# EAGLE design RFM69Pi_V3.1 (EAGLE 7.2.0)
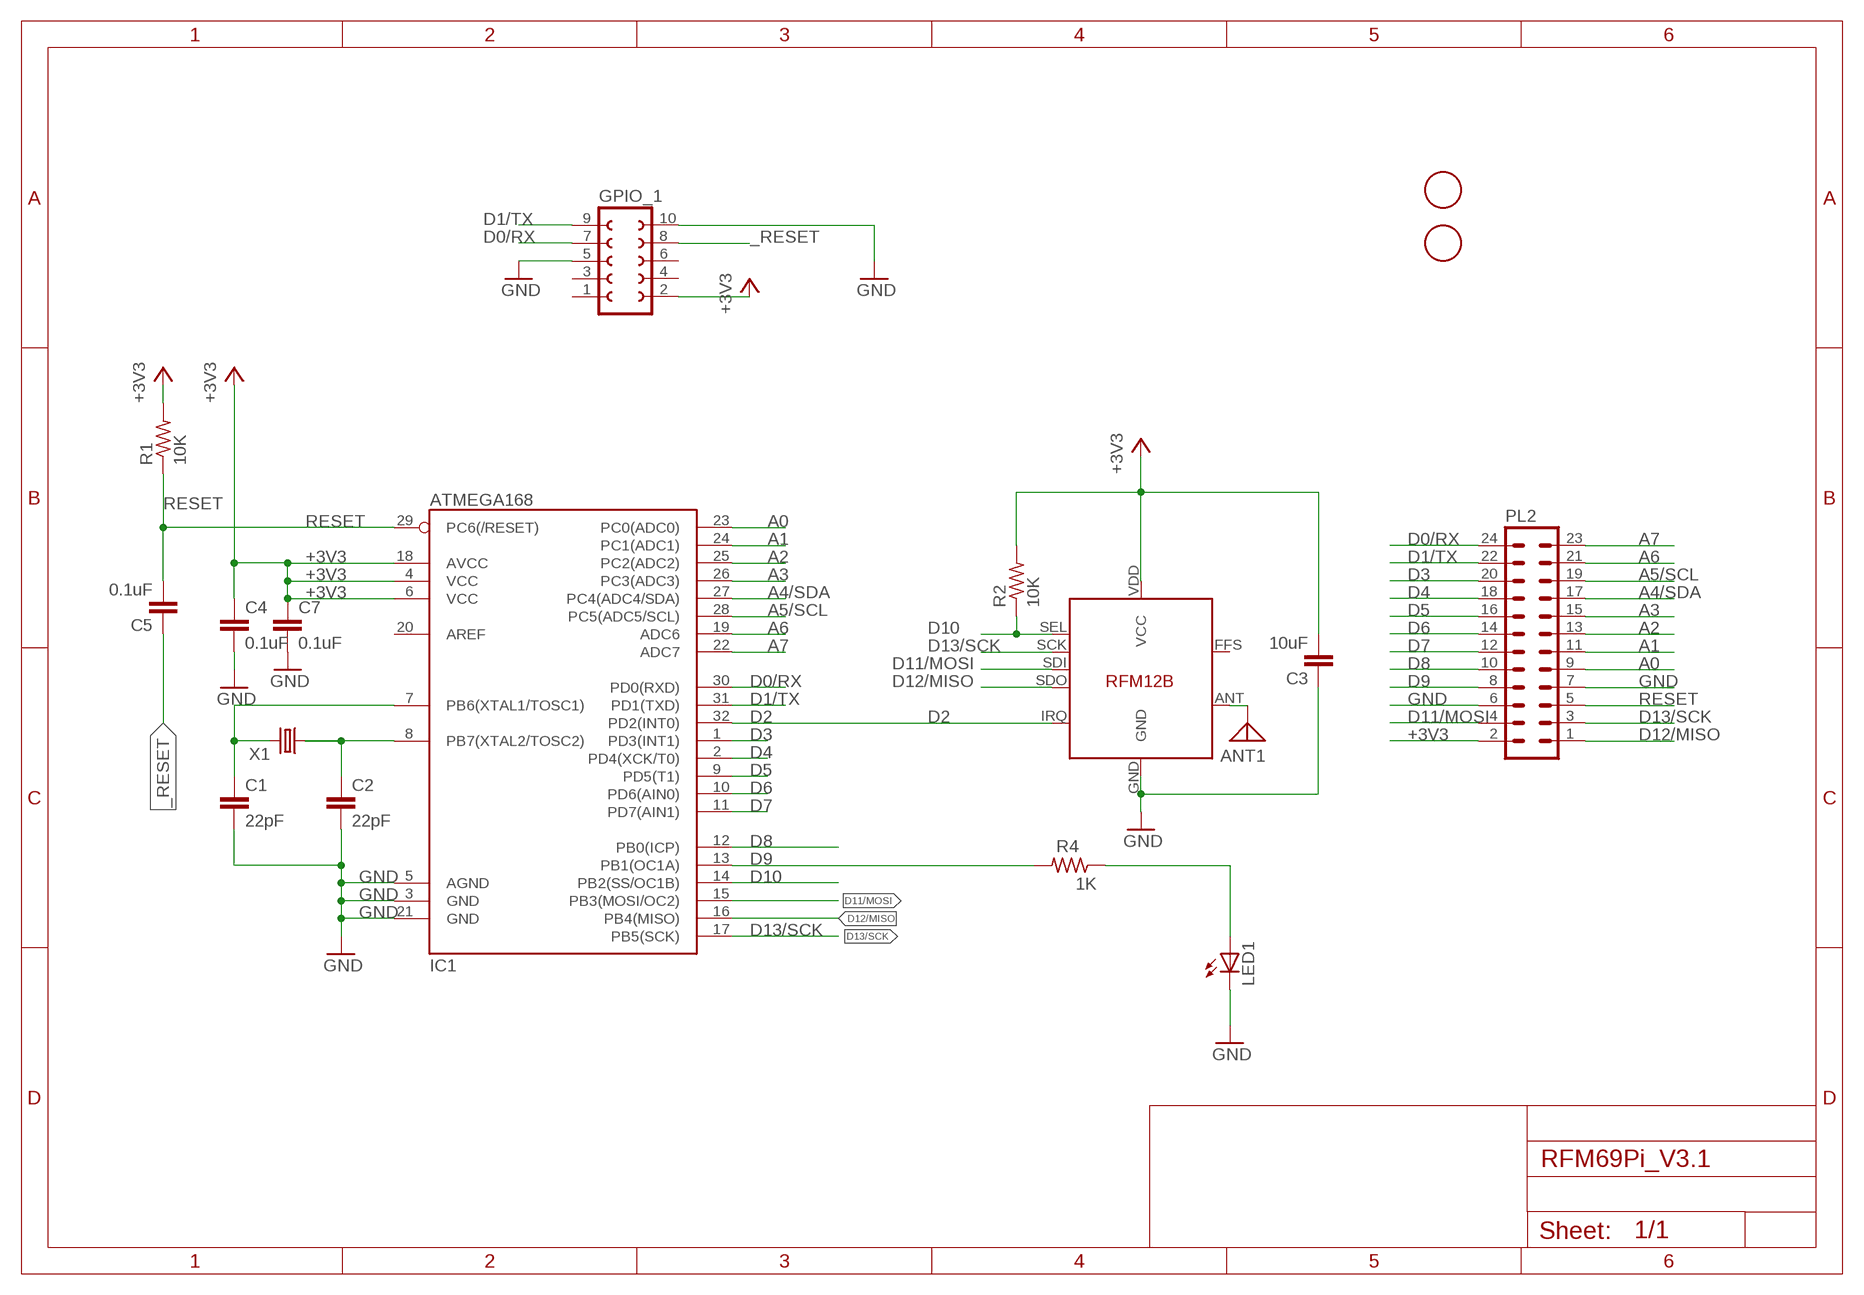
[diagram p0: schematic, sheet 1]

## Parts
ANT1  ANTENNA  [PAD-01]
C1  22pF  C-EUC0603  [C0603]
C2  22pF  C-EUC0603  [C0603]
C3  10uF  C-EUC0603  [C0603]
C4  0.1uF  C-EUC0603  [C0603]
C5  0.1uF  C-EUC0603  [C0603]
C7  0.1uF  C-EUC0603  [C0603]
GPIO_1  FE05-2  [FE05-2]
IC1  ATMEGA168  [TQFP32-08]
LED1  LEDSML0603  [SML0603]
PL2  MA12-2  [MA12-2]
R1  10K  R-US_R0603  [R0603]
R2  10K  R-US_R0603  [R0603]
R4  1K  R-US_R0603  [R0603]
RFM12B-RFM69CW  RFM12B  [RFM12B]
U$1  FIDUCIAL  [FIDUCIAL_1MM]
U$2  FIDUCIAL  [FIDUCIAL_1MM]
X1  CRYSTALHC49US  [HC49US]

## Nets
+3V3 [power]: C3.2 C4.1 C7.1 GPIO_1.2 IC1.4(VCC) IC1.6(VCC) IC1.18(AVCC) PL2.2 R1.2 R2.2 RFM12B-RFM69CW.VDD(VCC)
_RESET: C5.1 GPIO_1.8
A0: IC1.23(PC0(ADC0)) PL2.9
A1: IC1.24(PC1(ADC1)) PL2.11
A2: IC1.25(PC2(ADC2)) PL2.13
A3: IC1.26(PC3(ADC3)) PL2.15
A4/SDA: IC1.27(PC4(ADC4/SDA)) PL2.17
A5/SCL: IC1.28(PC5(ADC5/SCL)) PL2.19
A6: IC1.19(ADC6) PL2.21
A7: IC1.22(ADC7) PL2.23
D0/RX: GPIO_1.7 IC1.30(PD0(RXD)) PL2.24
D1/TX: GPIO_1.9 IC1.31(PD1(TXD)) PL2.22
D2: IC1.32(PD2(INT0)) RFM12B-RFM69CW.IRQ
D3: IC1.1(PD3(INT1)) PL2.20
D4: IC1.2(PD4(XCK/T0)) PL2.18
D5: IC1.9(PD5(T1)) PL2.16
D6: IC1.10(PD6(AIN0)) PL2.14
D7: IC1.11(PD7(AIN1)) PL2.12
D8: IC1.12(PB0(ICP)) PL2.10
D9: IC1.13(PB1(OC1A)) PL2.8 R4.2
D10: IC1.14(PB2(SS/OC1B)) R2.1 RFM12B-RFM69CW.SEL
D11/MOSI: IC1.15(PB3(MOSI/OC2)) PL2.4 RFM12B-RFM69CW.SDI
D12/MISO: IC1.16(PB4(MISO)) PL2.1 RFM12B-RFM69CW.SDO
D13/SCK: IC1.17(PB5(SCK)) PL2.3 RFM12B-RFM69CW.SCK
GND [power]: C1.2 C2.2 C3.1 C4.2 C7.2 GPIO_1.5 GPIO_1.10 IC1.3(GND) IC1.5(AGND) IC1.21(GND) LED1.C PL2.6 PL2.7 RFM12B-RFM69CW.GND
N$1: C1.1 IC1.7(PB6(XTAL1/TOSC1)) X1.2
N$2: C2.1 IC1.8(PB7(XTAL2/TOSC2)) X1.1
N$3: LED1.A R4.1
N$6 [power]: ANT1.1 RFM12B-RFM69CW.ANT
RESET: C5.2 IC1.29(PC6(/RESET)) PL2.5 R1.1
Unconnected: GPIO_1.1 GPIO_1.3 GPIO_1.4 GPIO_1.6 IC1.20(AREF) RFM12B-RFM69CW.FFS

## Library data of the parts
ANT1 = discrete:ANTENNA: Antenna
C1-C5 = rcl:C-EU: CAPACITOR, European symbol
C7 = resistor:C-EU: CAPACITOR, European symbol
GPIO_1 = con-lsta:FE05-2: FEMALE HEADER; OC_FARNELL: unknown; OC_NEWARK: unknown
IC1 = SparkFun:ATMEGA168
LED1 = led:LED: LED OSRAM: - CHIPLED LG R971, LG N971, LY N971, LG Q971, LY Q971, LO R971, LY R971 LH N974, LH R974 LS Q976, LO Q976, LY Q976 LO Q996 - Hyper CHIPLED LW Q18S LB Q993, LB Q99A, LB R99A - SideLED LS A670, LO A670, LY A670, LG A670, LP A670 LB A673, LV A673, LT A673, LW A673 LH A674 LY A675 LS A676, LA A676, LO A676, LY A676, LW A676 LS A679, LY A679, LG A679 - Hyper Micro SIDELED® LS Y876, LA Y876, LO Y876, LY Y876 LT Y87S - SmartLED LW L88C, LW L88S LB L89C, LB L89S, LG L890 LS L89K, LO L89K, LY L89K LS L896, LA L896, LO L896, LY L896 - TOPLED LS T670, LO T670, LY T670, LG T670, LP T670 LSG T670, LSP T670, LSY T670, LOP T670, LYG T670 LG T671, LOG T671, LSG T671 LB T673, LV T673, LT T673, LW T673 LH T674 LS T676, LA T676, LO T676, LY T676, LB T676, LH T676, LSB T676, LW T676 LB T67C, LV T67C, LT T67C, LS T67K, LO T67K, LY T67K, LW E67C LS E67B, LA E67B, LO E67B, LY E67B, LB E67C, LV E67C, LT E67C LW T67C LS T679, LY T679, LG T679 LS T770, LO T770, LY T770, LG T770, LP T770 LB T773, LV T773, LT T773, LW T773 LH T774 LS E675, LA E675, LY E675, LS T675 LS T776, LA T776, LO T776, LY T776, LB T776 LHGB T686 LT T68C, LB T68C - Hyper Mini TOPLED® LB M676 - Mini TOPLED Santana® LG M470 LS M47K, LO M47K, LY M47K Source: http://www.osram.convergy.de LUXEON: - LUMILED® LXK2-PW12-R00, LXK2-PW12-S00, LXK2-PW14-U00, LXK2-PW14-V00 LXK2-PM12-R00, LXK2-PM12-S00, LXK2-PM14-U00 LXK2-PE12-Q00, LXK2-PE12-R00, LXK2-PE12-S00, LXK2-PE14-T00, LXK2-PE14-U00 LXK2-PB12-K00, LXK2-PB12-L00, LXK2-PB12-M00, LXK2-PB14-N00, LXK2-PB14-P00, LXK2-PB14-Q00 LXK2-PR12-L00, LXK2-PR12-M00, LXK2-PR14-Q00, LXK2-PR14-R00 LXK2-PD12-Q00, LXK2-PD12-R00, LXK2-PD12-S00 LXK2-PH12-R00, LXK2-PH12-S00 LXK2-PL12-P00, LXK2-PL12-Q00, LXK2-PL12-R00 Source: www.luxeon.com KINGBRIGHT: KA-3528ASYC Source: www.kingbright.com
PL2 = con-lstb:MA12-2: PIN HEADER; OC_FARNELL: unknown; OC_NEWARK: unknown
R1 R2 R4 = adafruit:R-US_: RESISTOR, American symbol
RFM12B-RFM69CW = JeeLabs:RFM12B
U$1 U$2 = adafruit:FIDUCIAL: For use by pick and place machines to calibrate the vision/machine, 1mm By microbuilder.eu
X1 = SparkFun:CRYSTAL: Crystals Various standard crystals. Proven footprints. Spark Fun Electronics SKU : COM-00534

## Net classes
0 default: width 0.203 mm, drill 0.203 mm, clearance 0.205 mm
1 power: width 0.254 mm, drill 0.254 mm, clearance 0.205 mm to class 0, clearance 0.254 mm

## Board
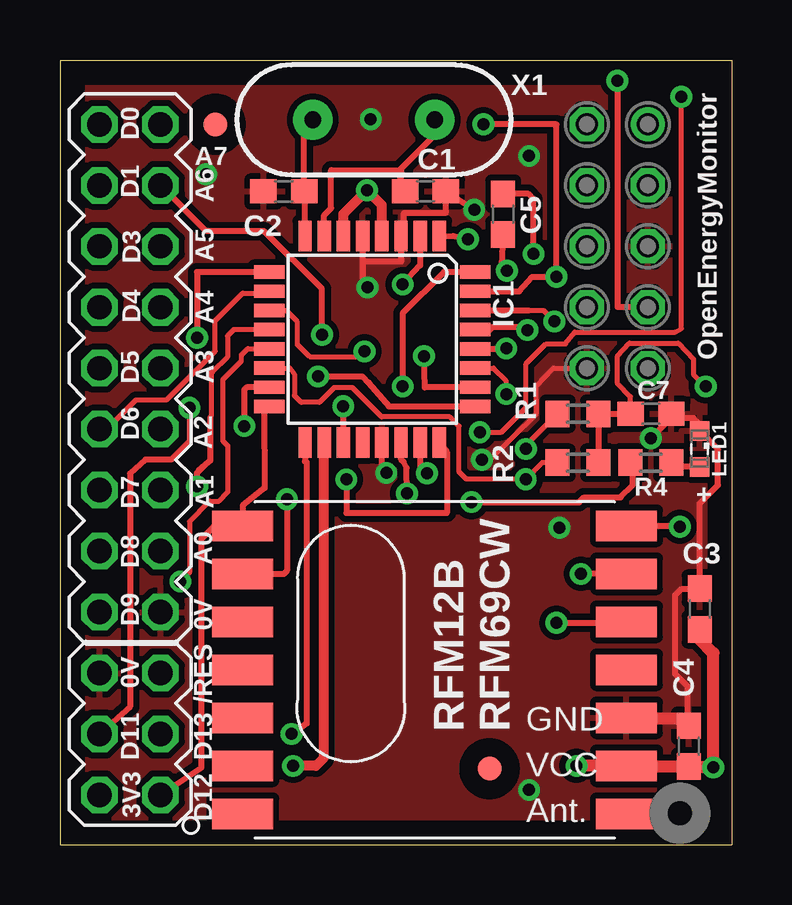
[diagram p1: board, top side]
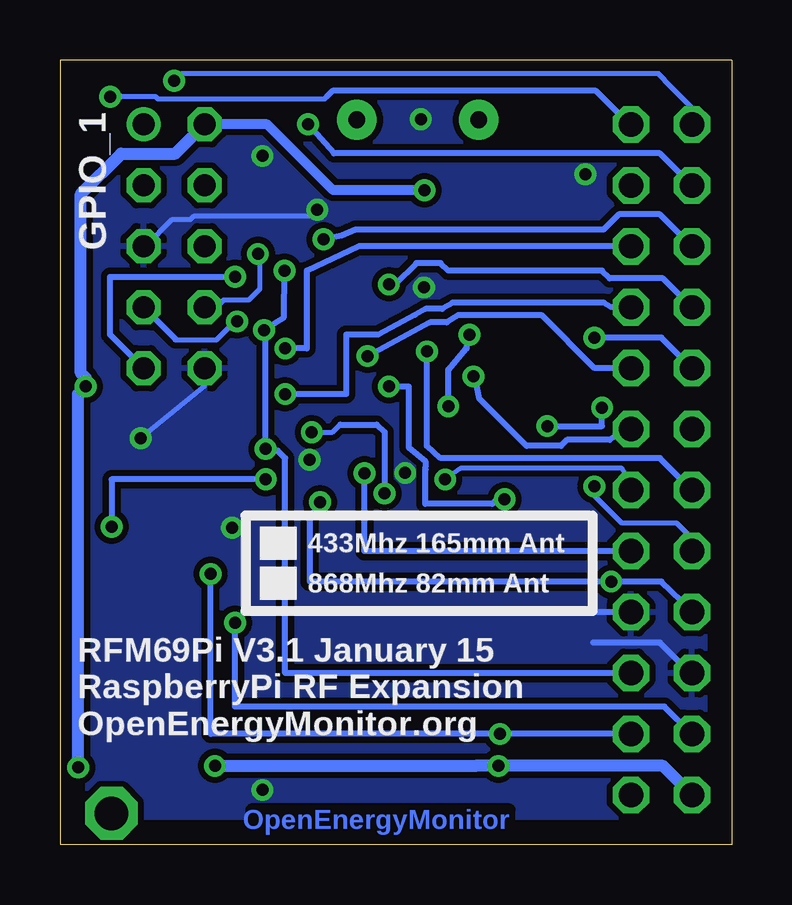
[diagram p2: board, bottom side, seen from below]

Size 28 x 32.7 mm. Coordinates in mm from the lower left corner, seen from the top.
Outline: 0,0 28,0 28,32.7 0,32.7 0,0
Copper layers (1*16): Top 0.035mm / dielectric 1.5mm / Bottom 0.035mm
Design rules "default *": minimum track width 10mil, minimum drill 19mil, track to track 6mil, track to pad 6mil, pad to pad 6mil, via to via 6mil, smd to smd 6mil, copper to edge 40mil, drill to drill 8mil, minimum pad ring 10mil, minimum via ring 8mil, stop-mask expansion 4mil, vias tented up to drill 0.6mm, thermal gap 10mil

### Footprints (pad centres in the part's own frame; a part is rotated, then mirrored left to right if it is on the bottom)
PAD-01 = drill 1.4 pad 2.2 octagon: 1 0,0
C0603 = smd 1.1 x 1: 1 -0.85,0; 2 0.85,0
FE05-2 = drill 0.914: 1 -5.08,1.27 | drill 0.914 octagon: 2 -5.08,-1.27; 3 -2.54,1.27; 4 -2.54,-1.27; 5 0,1.27; 6 0,-1.27; 7 2.54,1.27; 8 2.54,-1.27; 9 5.08,1.27; 10 5.08,-1.27
TQFP32-08 = smd 1.27 x 0.559: 1 -4.293,2.8; 2 -4.293,2; 3 -4.293,1.2; 4 -4.293,0.4; 5 -4.293,-0.4; 6 -4.293,-1.2; 7 -4.293,-2; 8 -4.293,-2.8; 17 4.293,-2.8; 18 4.293,-2; 19 4.293,-1.2; 20 4.293,-0.4; 21 4.293,0.4; 22 4.293,1.2; 23 4.293,2; 24 4.293,2.8 | smd 0.559 x 1.27: 9 -2.8,-4.293; 10 -2,-4.293; 11 -1.2,-4.293; 12 -0.4,-4.293; 13 0.4,-4.293; 14 1.2,-4.293; 15 2,-4.293; 16 2.8,-4.293; 25 2.8,4.293; 26 2,4.293; 27 1.2,4.293; 28 0.4,4.293; 29 -0.4,4.293; 30 -1.2,4.293; 31 -2,4.293; 32 -2.8,4.293
SML0603 = smd 0.8 x 0.8: A 0.75,0; C -0.75,0
MA12-2 = drill 1.016 octagon: 1 -13.97,-1.27; 2 -13.97,1.27; 3 -11.43,-1.27; 4 -11.43,1.27; 5 -8.89,-1.27; 6 -8.89,1.27; 7 -6.35,-1.27; 8 -6.35,1.27; 9 -3.81,-1.27; 10 -3.81,1.27; 11 -1.27,-1.27; 12 -1.27,1.27; 13 1.27,-1.27; 14 1.27,1.27; 15 3.81,-1.27; 16 3.81,1.27; 17 6.35,-1.27; 18 6.35,1.27; 19 8.89,-1.27; 20 8.89,1.27; 21 11.43,-1.27; 22 11.43,1.27; 23 13.97,-1.27; 24 13.97,1.27
R0603 = smd 1 x 1.1: 1 -0.85,0; 2 0.85,0
RFM12B = smd 2.54 x 1.27: ANT 8,-6; FFS -8,2; GND 8,-2; IRQ -8,4; P$8 -8,0; P$9 -8,-2; P$10 -8,-4; P$12 -8,-6; P$16 8,0; SCK 8,4; SDI 8,2; SDO -8,6; SEL 8,6; VDD 8,-4
FIDUCIAL_1MM = smd 1 x 1: 1 0,0
HC49US = drill 0.7 pad 1.651: 1 -2.54,0; 2 2.54,0

### Placement (x,y rotation side)
ANT1  25.85,1.31 0 top
C1  15.24,27.22 0 top
C2  9.33,27.22 180 top
C3  26.67,9.82 270 top
C4  26.23,4.11 90 top
C5  18.48,26.27 270 top
C7  24.64,17.95 0 top
GPIO_1  23.24,24.94 270 top
IC1  13.02,21.06 270 top
LED1  26.67,16.49 270 top
PL2  2.92,16.05 90 top
R1  21.59,17.95 0 top
R2  21.59,15.92 0 top
R4  24.64,15.92 180 top
RFM12B-RFM69CW  15.62,7.29 0 top
U$1  17.91,3.17 0 top
U$2  6.48,30.02 0 top
X1  13.08,30.21 0 top

### Tracks (layer width: path | path; a pad name or v marks a point on that pad's centre or on a via)
+3V3  (via drill 0.5)
  Top 0.203: IC1.4 | C7.1 23.79,18.68 23.24,19.22 23.24,20.37 23.75,20.9 25.78,20.9 26.42,20.24 26.42,19.6 v26.92,19.1
  Top 0.254: 23.65,3.26 RFM12B-RFM69CW.VDD 23.42,3.3 | 26.27,3.22 C4.1 | 10.99,16.8 IC1.18 | R2.2 R1.2 C7.1
  Top 0.406: IC1.6 11.82,26.29 v12.8,27.27 13.41,26.66 IC1.4 | 10.99,16.8 10.99,3.6 10.67,3.28 v9.72,3.28
  Top 0.508: C4.1 23.65,3.26 | 26.27,3.22 v27.24,3.22 27.24,7.98 26.67,8.55 C3.2 | 23.42,3.3 v21.54,3.28
  Bottom 0.254: v9.72,3.28 10.67,3.28
  Bottom 0.406: v12.8,27.27 16.61,27.27 19.36,30.02 GPIO_1.2
  Bottom 0.508: PL2.2 2.86,3.28 10.67,3.28 v21.54,3.28 | GPIO_1.2 23.19,28.8 25.45,28.8 27.13,27.12 27.13,19.66 26.92,19.45 v26.92,19.1 27.24,18.78 v27.24,3.22
_RESET  (via drill 0.5)
  Top 0.254: v19.75,24.62 19.75,26.91 19.53,27.12 C5.1
  Bottom 0.203: GPIO_1.8 21.46,22.4 21.16,22.7 20.12,22.7 19.66,23.16 19.66,24.53 v19.75,24.62
A0  (via drill 0.5)
  Top 0.254: IC1.23 15.02,15.7 v15.3,15.48
  Bottom 0.254: PL2.9 15.3,12.24 v15.3,15.48
A1  (via drill 0.5)
  Top 0.254: v11.94,15.22 11.94,13.82 16.13,13.82 16.14,16.37 IC1.24
  Bottom 0.203: PL2.11 4.19,15.1 4.57,15.68 11.3,15.68 v11.94,15.22
A2  (via drill 0.5)
  Top 0.254: IC1.25 13.72,18.27 12.87,19.25 12.61,19.52 v10.76,19.52
  Bottom 0.254: PL2.13 4.51,17.32 4.89,17 5.08,16.87 6.86,16.87 7.11,16.62 8.55,16.62 10.52,18.59 10.67,19.43 v10.76,19.52
A3  (via drill 0.5)
  Top 0.254: IC1.26 15.21,19.06 v15.18,20.37
  Bottom 0.254: PL2.15 5.71,19.86 7.94,22.08 11.37,22.08 11.87,21.76 12.57,21.76 v15.18,20.37
A4/SDA  (via drill 0.5)
  Top 0.203: IC1.27 18.08,19.86 18.59,19.35 18.59,18.79 v18.61,18.78
  Bottom 0.254: PL2.17 5.02,22.4 5.33,22.59 11.62,22.59 12.06,22.33 12.76,22.33 13.21,22.08 14.73,21.25 16.07,21.25 16.07,18.78 v18.61,18.78
A5/SCL  (via drill 0.5)
  Top 0.254: IC1.28 18.59,20.66 v18.61,20.68
  Bottom 0.254: PL2.19 15.56,24.94 17.72,23.92 17.72,20.68 v18.61,20.68
A6  (via drill 0.5)
  Top 0.254: IC1.19 11.82,17.82 v11.81,18.27 | PL2.21 6.1,25.57 8.51,25.57 10.92,23.16 v10.92,21.25
  Bottom 0.254: v11.81,18.27 11.81,19.79 11.05,20.68 v10.92,21.25
A7  (via drill 0.5)
  Top 0.203: v17.5,17.19 18.41,17.19 19.43,18.21 19.43,20.04 20.27,20.87 21.08,20.87 21.46,21.36 25.65,21.36 25.91,21.51 v25.91,31.17
  Top 0.254: v14.46,14.64 14.45,15.71 14.33,15.96 14.22,16.05 IC1.22
  Bottom 0.203: 25.45,31.19 24.03,31.19 23.93,31.09 16.97,31.09 16.87,31.19 | 16.32,17.51 16.64,17.19 v17.5,17.19 17.72,17.19
  Bottom 0.254: PL2.23 4.25,30.02 5.65,31.41 16.64,31.41 16.87,31.19 | v14.46,14.64 14.46,17.19 14.8,17.51 16.32,17.51 | 25.45,31.19 v25.91,31.17
D0/RX  (via drill 0.5)
  Top 0.203: 19.55,22.27 20.16,22.27 v20.62,21.81
  Top 0.254: IC1.30 19.3,22.27 19.55,22.27 | v23.24,31.83 23.24,22.4 GPIO_1.7
  Bottom 0.203: v20.62,21.81 20.71,21.81 21.49,21.03 23.14,21.03 23.18,21.06 | PL2.24 1.65,30.71 2.77,31.83 2.77,31.85 3.05,32.13 22.94,32.13 v23.24,31.83
  Bottom 0.254: 23.18,21.06 GPIO_1.7
D1/TX  (via drill 0.5)
  Top 0.254: IC1.31 19.14,23.06 19.68,23.67 v20.7,23.67 20.7,30.02 v17.65,30.02
  Bottom 0.254: PL2.22 2.98,28.81 16.57,28.81 v17.65,30.02 | GPIO_1.9 25.91,21.25 25.91,23.67 v20.7,23.67
D2  (via drill 0.5)
  Top 0.254: RFM12B-RFM69CW.IRQ 9.33,11.29 9.46,11.41 v9.46,14.4 | IC1.32 16.01,23.86 14.29,22.14 v14.29,19.1
  Bottom 0.254: v9.46,14.4 9.78,14.4 9.97,14.21 12.76,14.21 12.76,15.6 12.75,15.64 12.76,15.73 12.76,15.98 13.46,16.56 13.46,19.1 v14.29,19.1
D3  (via drill 0.5)
  Top 0.254: IC1.1 16.39,25.38 v17,25.23
  Bottom 0.254: PL2.20 2.98,26.27 4.7,26.27 5.33,25.64 15.68,25.64 16.26,25.38 v17,25.23
D4  (via drill 0.5)
  Top 0.254: IC1.2 15.02,24.14 v14.29,23.35
  Bottom 0.254: PL2.18 2.86,23.61 5.08,23.61 5.4,23.92 11.81,23.92 12.13,24.24 13.14,24.24 14.03,23.35 v14.29,23.35
D5  (via drill 0.5)
  Top 0.254: IC1.9 6.79,23.86 5.71,23.86 v5.71,21.13
  Bottom 0.254: PL2.16 2.92,21.13 v5.71,21.13
D6
  Top 0.203: PL2.14 1.95,17.32 3.17,18.54 4.45,18.54 6.48,20.57 6.48,21.84 7.62,22.99 8.65,22.99 IC1.10
D7  (via drill 0.5)
  Top 0.203: IC1.11 8.74,22.25 9.45,22.25 9.91,21.79 9.91,20.83 10.41,20.34 12.49,20.34 v12.7,20.56
  Bottom 0.254: PL2.12 2.98,16.11 12.13,16.11 12.7,16.62 v12.7,20.56
D8  (via drill 0.5)
  Top 0.203: 6.29,17.74 6.27,17.8 6.3,17.83 6.3,19.66 6.33,19.68 6.35,19.68 6.99,20.32 6.99,21.21 7.24,21.46 IC1.12
  Top 0.254: 5.79,15.62 6.07,15.85 | 6.07,15.85 6.27,16.02 6.27,17.8 | v5.71,14.93 5.71,15.5 6.07,15.85
  Bottom 0.203: PL2.10 1.65,12.77 2.29,13.41 4.57,13.41 5.71,14.55 v5.71,14.93
D9  (via drill 0.5)
  Top 0.203: v5.02,10.97 5.4,11.35 5.4,13.47 6.25,14.32 6.63,14.32 7.01,14.7 7.01,16.61 6.79,16.82 6.79,19.39 7.57,20.17 7.57,20.42 7.82,20.68 8.71,20.68 IC1.13
  Top 0.254: v17.16,14.28 17.2,14.28 17.46,14.27 21.64,14.27 21.84,14.48 23.37,14.48 23.88,14.99 23.88,15.83 R4.2
  Bottom 0.254: PL2.8 1.65,9.76 2.92,10.97 v5.02,10.97 17.59,10.97 17.59,13.63 17.22,14.07 v17.16,14.28
D10  (via drill 0.5)
  Top 0.203: IC1.14 9.59,19.86 9.77,19.61 9.78,18.71 10.06,18.44 10.82,18.44 11.43,19.05 12.19,19.05 13.41,17.83 16.26,17.83 16.64,17.45 16.64,15.54 16.94,15.23 v19.42,15.23 20.1,15.92 R2.1
  Top 0.254: 23.44,13.49 RFM12B-RFM69CW.SEL 25.81,13.29 v25.84,13.25
  Bottom 0.254: v19.42,15.23 25.84,15.22 v25.84,13.25
D11/MOSI  (via drill 0.5)
  Top 0.254: v20.7,9.25 23.59,9.25 RFM12B-RFM69CW.SDI | IC1.15 7.78,19.06 7.68,18.97 v7.68,17.45 | v5.4,18.21 5.4,16.81 4.64,16.05 3.56,16.05 2.92,15.48 2.92,5.76 PL2.4
  Bottom 0.254: PL2.4 2.79,5.76 20.7,5.76 v20.7,9.25 | v7.68,17.45 5.4,17.45 v5.4,18.21
D12/MISO
  Top 0.254: PL2.1 5.91,3.22 5.91,12.76 6.4,13.25 7.59,13.25 RFM12B-RFM69CW.SDO 7.62,14.14 8.53,14.87 8.51,18.08 8.72,18.23 IC1.16
D13/SCK  (via drill 0.5)
  Top 0.254: RFM12B-RFM69CW.SCK v21.72,11.29 | IC1.17 10.22,15.98 10.29,15.92 10.29,5.06 9.72,4.62 v9.65,4.62
  Bottom 0.254: v21.72,11.29 21.72,4.62 v9.65,4.62 PL2.3
GND  (via drill 0.5)
  Top 0.203: 21.54,19.86 GPIO_1.10 20.57,19.86 19.86,19.1 19.86,17.95 17.86,16 17.54,16 v17.59,16.05
  Top 0.254: 26.23,5.25 C4.2 26.16,5.02 26.16,6.6 25.65,7.11 25.65,10.41 25.91,10.67 C3.1 26.67,14.22 27.43,14.99 27.43,16.48 LED1.C 26.67,17.46 26.66,17.48 26.66,17.54 26.42,17.78 25.66,17.78 C7.2 25.49,17.79 v24.64,16.94 | 23.65,5.25 RFM12B-RFM69CW.GND | v17.27,26.46 C1.2 16.09,26.34 14.35,26.34 14.35,25.36 IC1.3 14.22,24.37 14.22,24.3 12.64,24.3 12.64,25.27 IC1.5 12.62,23.43 v12.83,23.22 | IC1.21 13.4,15.67 13.57,15.49 v13.61,15.49
  Top 0.406: RFM12B-RFM69CW.GND 26.16,5.29
  Top 0.508: 26.23,5.25 23.65,5.25
  Bottom 0.203: 21.97,19.1 v24.64,16.94 | GPIO_1.5 24.43,24.94 23.32,26.06 22.55,26.06 22.4,26.21 17.53,26.21 v17.27,26.46
  Bottom 0.254: PL2.6 1.71,7.16 2.98,8.43 5.78,8.43 | PL2.7 5.78,9.7 | v12.83,23.22 12.83,22.91 | v13.61,15.49 13.4,15.6
  other vias: 12.95,30.23 6.1,27.94 19.56,2.29 20.83,13.21 19.56,28.7
  pour Top (isolate 0.203): -0.13,32.81 27.94,32.81 27.94,0.04 -0.13,-0.06
  pour Bottom (isolate 0.203): 0,32.69 27.88,32.69 27.88,0.1 -0.1,-0.1
N$1
  Top 0.254: IC1.7 11.02,26.24 11.3,26.53 11.3,28.11 14.22,28.11 14.2,27.76 | 14.2,27.76 14.2,28.15 15.62,29.57 X1.2 | C1.1 14.2,27.16 14.2,27.76
N$2
  Top 0.254: IC1.8 10.22,26.94 C2.1 10.18,29.85 X1.1
N$3
  Top 0.254: LED1.A 25.67,15.74 R4.1
N$6
  Top 0.762: RFM12B-RFM69CW.ANT 25.68,1.28
  Top 0.813: ANT1.1 23.65,1.31 RFM12B-RFM69CW.ANT
RESET  (via drill 0.5)
  Top 0.203: v19.43,16.49 19.43,16.64 R1.1
  Top 0.254: v19.49,21.45 19.37,21.57 18.03,21.57 17.91,21.45 17.33,21.45 IC1.29 | v18.63,23.92 18.43,24.12 18.49,25.39 C5.2 | R1.1 20.74,17.8
  Bottom 0.254: PL2.5 18.61,7.16 18.61,16.11 18.92,16.43 19.37,16.43 v19.43,16.49 19.43,21.38 v19.49,21.45 19.36,21.53 18.66,21.99 v18.63,23.92

### Text on the board
Bottom: OpenEnergyMonitor
tNames: D0 | A7 | D1 | A6 | D3 | A5 | D4 | A4 | OpenEnergyMonitor | D5 | A3 | D6 | A2 | + | D7 | A1 | D8 | A0 | D9 | 0V | 0V | /RES | RFM12B / RFM69CW | D11 | D13 | 3V3 | D12
bNames: 433Mhz 165mm Ant | 868Mhz 82mm Ant | RFM69Pi V3.1 January 15 / RaspberryPi RF Expansion / OpenEnergyMonitor.org